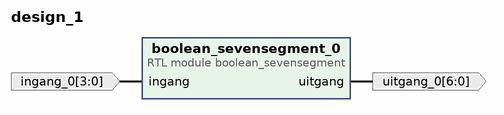
[diagram p0: block diagram of the top level]
# Vivado block design design_1, xc7z010iclg225-1L, Vivado 2023.2
create_bd_design design_1

create_bd_port -dir O -from 6 -to 0 uitgang_0
create_bd_port -dir I -from 3 -to 0 ingang_0

create_bd_cell -type module -reference boolean_sevensegment boolean_sevensegment_0

# ---- connections ----

connect_bd_net [get_bd_pins boolean_sevensegment_0/uitgang] [get_bd_ports uitgang_0]
connect_bd_net -net ingang_0_1 [get_bd_ports ingang_0] [get_bd_pins boolean_sevensegment_0/ingang]

validate_bd_design
save_bd_design
